# EAGLE schematic M8341D (EAGLE 6.6.0)

## Sheet 1 of 2
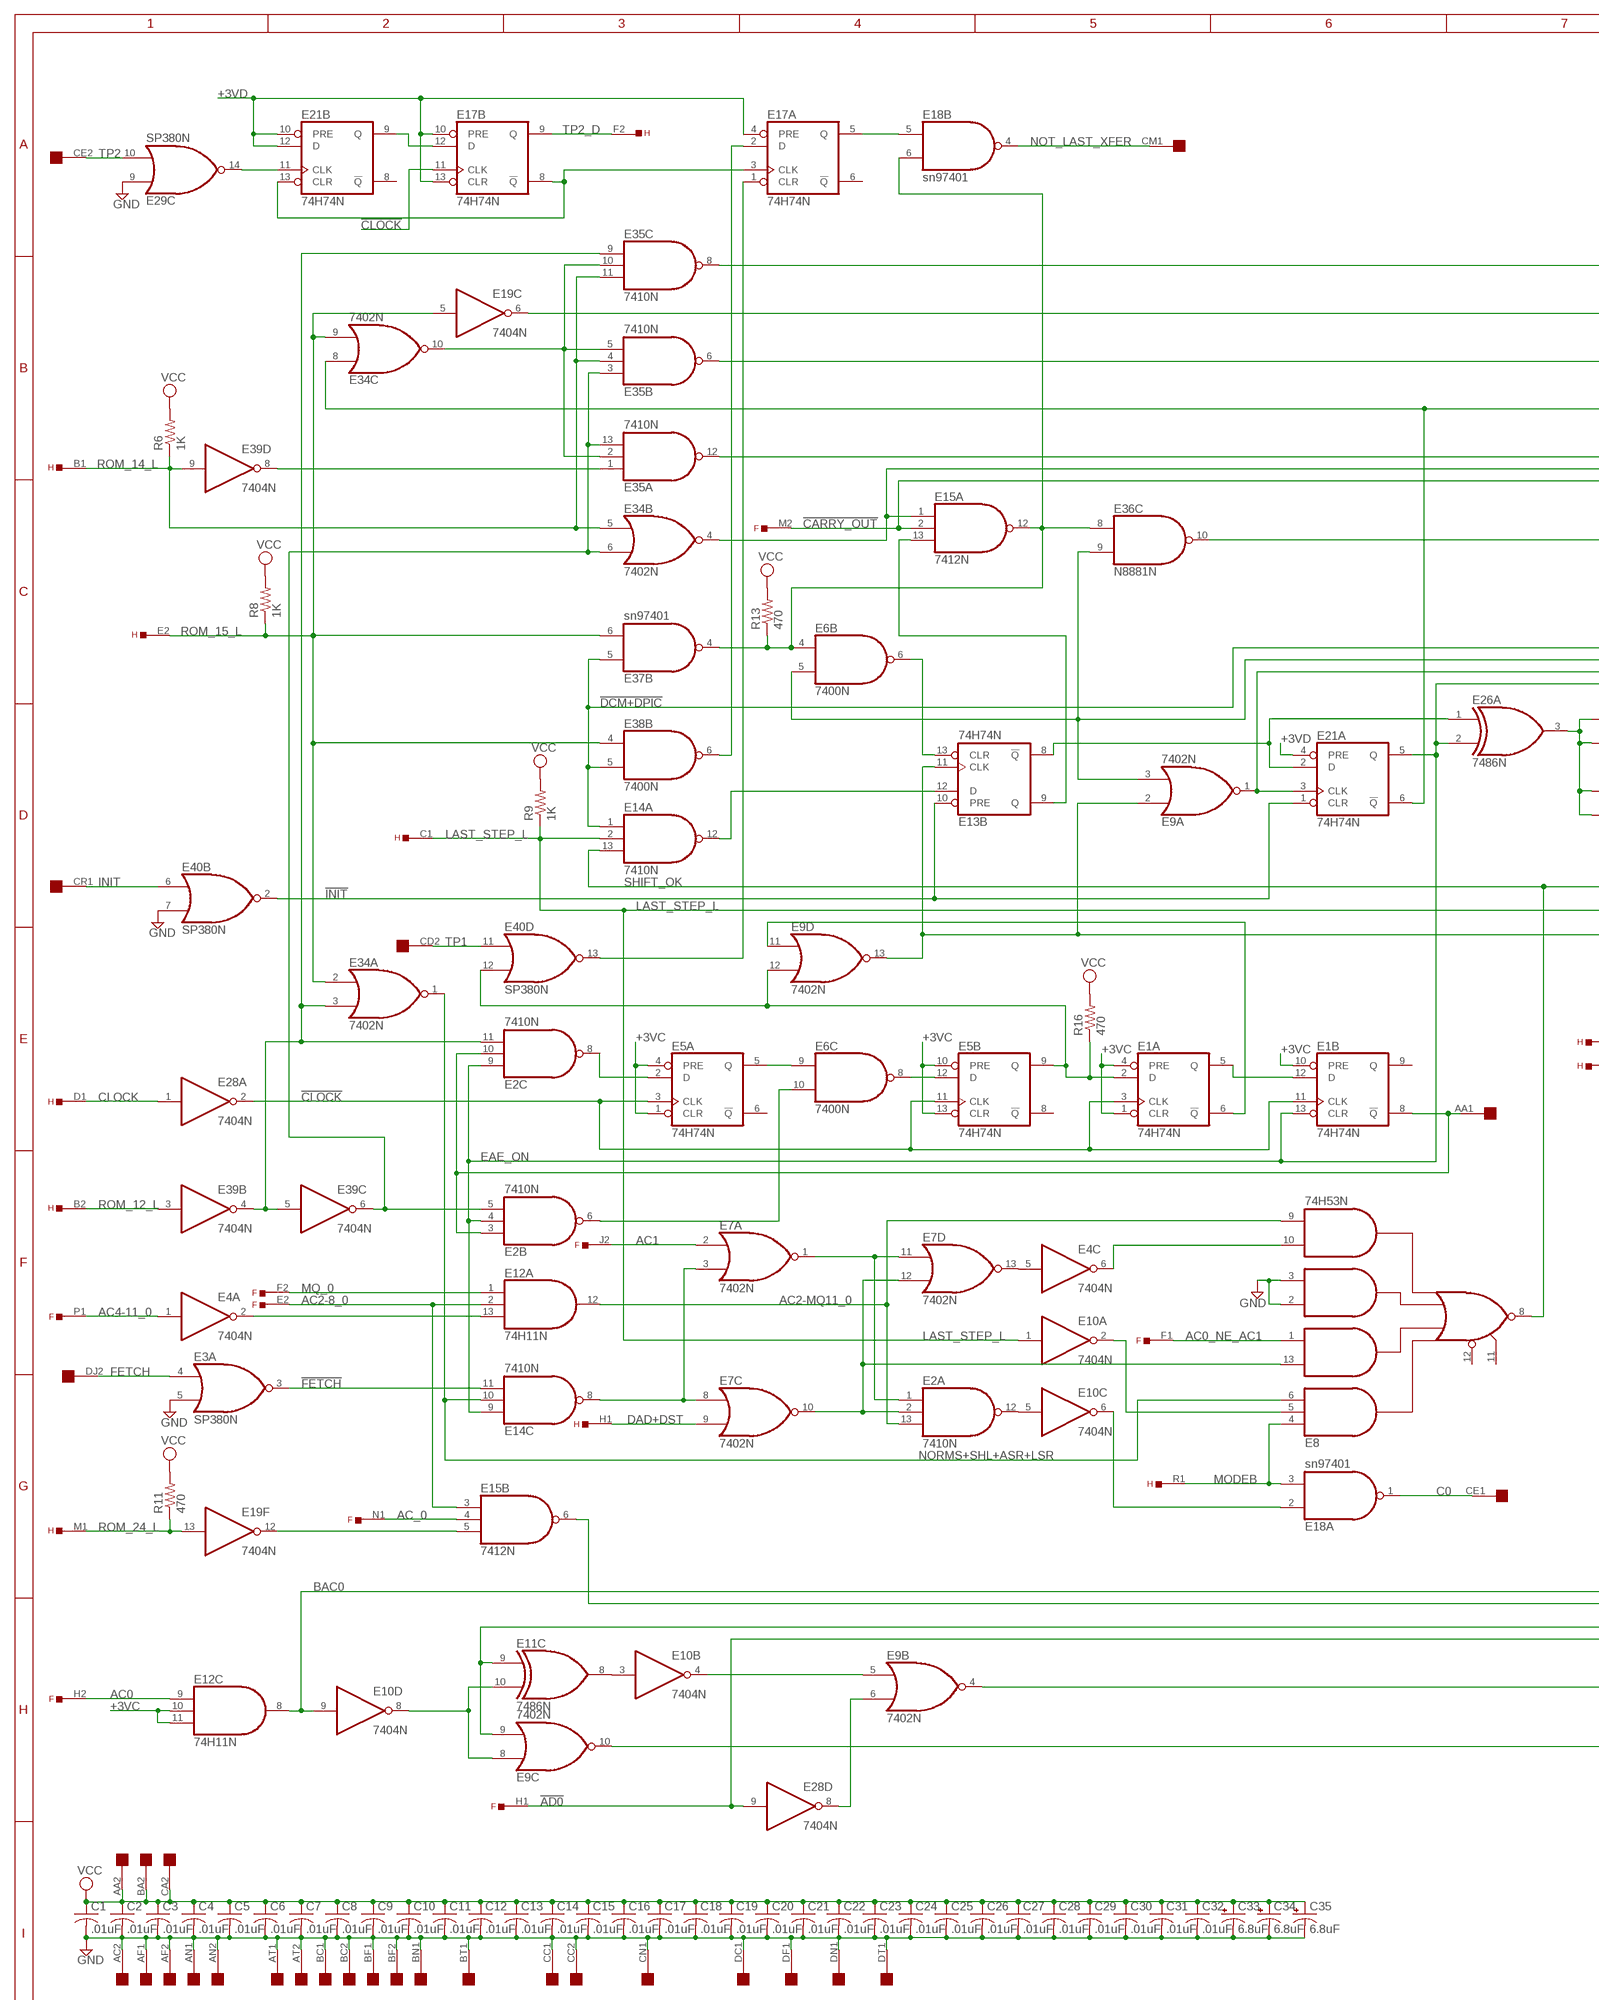
[diagram p0: schematic, sheet 1, part 1 of 2]
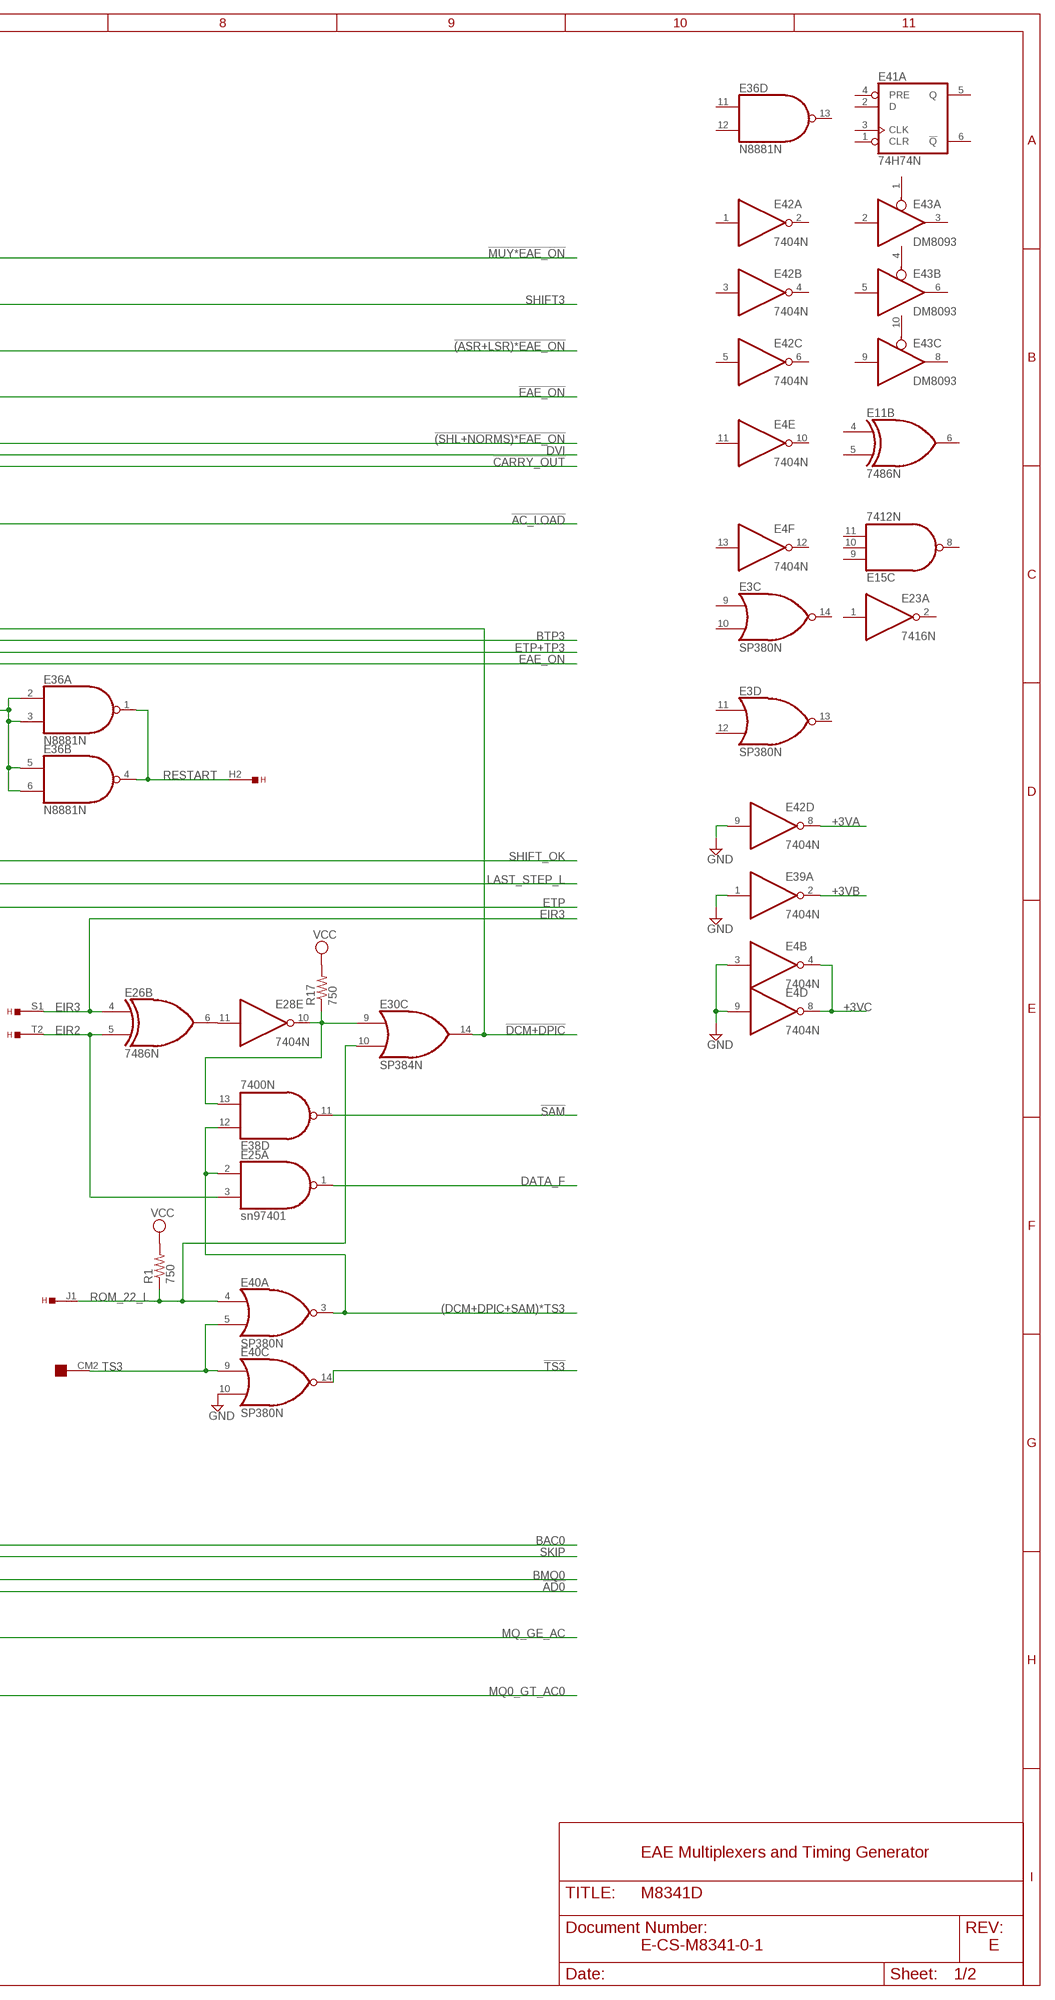
[diagram p1: schematic, sheet 1, part 2 of 2]

### Parts
C1  .01uF  C-US  [C063-025X075]
C2  .01uF  C-US  [C063-025X075]
C3  .01uF  C-US  [C063-025X075]
C4  .01uF  C-US  [C063-025X075]
C5  .01uF  C-US  [C063-025X075]
C6  .01uF  C-US  [C063-025X075]
C7  .01uF  C-US  [C063-025X075]
C8  .01uF  C-US  [C063-025X075]
C9  .01uF  C-US  [C063-025X075]
C10  .01uF  C-US  [C063-025X075]
C11  .01uF  C-US  [C063-025X075]
C12  .01uF  C-US  [C063-025X075]
C13  .01uF  C-US  [C063-025X075]
C14  .01uF  C-US  [C063-025X075]
C15  .01uF  C-US  [C063-025X075]
C16  .01uF  C-US  [C063-025X075]
C17  .01uF  C-US  [C063-025X075]
C18  .01uF  C-US  [C063-025X075]
C19  .01uF  C-US  [C063-025X075]
C20  .01uF  C-US  [C063-025X075]
C21  .01uF  C-US  [C063-025X075]
C22  .01uF  C-US  [C063-025X075]
C23  .01uF  C-US  [C063-025X075]
C24  .01uF  C-US  [C063-025X075]
C25  .01uF  C-US  [C063-025X075]
C26  .01uF  C-US  [C063-025X075]
C27  .01uF  C-US  [C063-025X075]
C28  .01uF  C-US  [C063-025X075]
C29  .01uF  C-US  [C063-025X075]
C30  .01uF  C-US  [C063-025X075]
C31  .01uF  C-US  [C063-025X075]
C32  .01uF  C-US  [C063-025X075]
C33  6.8uF  CPOL-USE20-8AXIAL  [E12-8]
C34  6.8uF  CPOL-USE20-8AXIAL  [E12-8]
C35  6.8uF  CPOL-USE20-8AXIAL  [E12-8]
E1  74H74N  74S74N  [DIL14]
E2  7410N  [DIL14]
E3  SP380N  [DIL14]
E4  7404N  [DIL14]
E5  74H74N  74S74N  [DIL14]
E6  7400N  [DIL14]
E7  7402N  [DIL14]
E8  74H53N  [DIL14]
E9  7402N  [DIL14]
E10  7404N  [DIL14]
E11  7486N  [DIL14]
E12  74H11N  74S11N  [DIL14]
E13  74H74N  74S74N  [DIL14]
E14  7410N  [DIL14]
E15  7412N  [DIL14]
E17  74H74N  74S74N  [DIL14]
E18  sn97401  74LS01N  [DIL14]
E19  7404N  [DIL14]
E21  74H74N  74S74N  [DIL14]
E23  7416N  [DIL14]
E25  sn97401  74LS01N  [DIL14]
E26  7486N  [DIL14]
E28  7404N  [DIL14]
E29  SP380N  [DIL14]
E30  SP384N  [DIL14]
E34  7402N  [DIL14]
E35  7410N  [DIL14]
E36  N8881N  [DIL14]
E37  sn97401  74LS01N  [DIL14]
E38  7400N  [DIL14]
E39  7404N  [DIL14]
E40  SP380N  [DIL14]
E41  74H74N  74S74N  [DIL14]
E42  7404N  [DIL14]
E43  DM8093  74125N  [DIL14]
F  EDGE-TOP  [EDGE-CON2]
H  EDGE-TOP  [EDGE-CON2]
R1  750  R-US_0207/10  [0207/10]
R6  1K  R-US_0207/10  [0207/10]
R8  1K  R-US_0207/10  [0207/10]
R9  1K  R-US_0207/10  [0207/10]
R11  470  R-US_0207/10  [0207/10]
R13  470  R-US_0207/10  [0207/10]
R16  470  R-US_0207/10  [0207/10]
R17  750  R-US_0207/10  [0207/10]
U$2  QUAD  [EDGE-CON8]

### Nets
!(ASR+LSR)*EAE_ON: E35.6(B:O) ; also sheet 2
!(SHL+NORMS)*EAE_ON: E35.12(A:O) ; also sheet 2
!AC_LOAD: E36.10(C:O) ; also sheet 2
!AD0: E28.9(D:I) F.H1 ; also sheet 2
!CARRY_OUT: E15.2(A:I1) F.M2 ; also sheet 2
!CLOCK: E1.3(A:CLK) E1.11(B:CLK) E5.3(A:CLK) E5.11(B:CLK) E17.11(B:CLK) E28.2(A:O)
!DCM+DPIC: E14.1(A:I0) E30.14(C:O) E37.5(B:I0) E38.5(B:I1) ; also sheet 2
!EAE_ON: E21.6(A:!Q) E34.8(C:I0) ; also sheet 2
!FETCH: E3.3(A:O) E14.11(C:I2)
!INIT: E13.10(B:PRE) E21.1(A:CLR) E40.2(B:O)
!MUY*EAE_ON: E35.8(C:O) ; also sheet 2
!SAM: E38.11(D:O) ; also sheet 2
!TS3: E40.14(C:O) ; also sheet 2
(DCM+DPIC+SAM)*TS3: E25.2(A:I0) E38.12(D:I0) E40.3(A:O) ; also sheet 2
+3VA: E42.8(D:O) ; also sheet 2
+3VB: E39.2(A:O) ; also sheet 2
+3VC: E1.1(A:CLR) E1.4(A:PRE) E1.10(B:PRE) E4.4(B:O) E4.8(D:O) E5.1(A:CLR) E5.4(A:PRE) E5.10(B:PRE) E5.13(B:CLR) E12.10(C:I1) E12.11(C:I2) ; also sheet 2
+3VD: E17.4(A:PRE) E17.10(B:PRE) E17.13(B:CLR) E21.4(A:PRE) E21.10(B:PRE) E21.12(B:D) ; also sheet 2
AC0: E12.9(C:I0) F.H2
AC0_NE_AC1: E8.1(I4) F.F1
AC1: E7.2(A:I0) F.J2
AC2-8_0: E12.2(A:I1) E15.3(B:I0) F.E2
AC2-MQ11_0: E2.13(A:I2) E8.9(I8) E12.12(A:O)
AC4-11_0: E4.1(A:I) F.P1
AC_0: E15.4(B:I1) F.N1
BAC0: E10.9(D:I) E12.8(C:O) ; also sheet 2
BMQ0: E9.9(C:I1) E11.9(C:I0) ; also sheet 2
BTP3: E6.5(B:I1) E9.3(A:I1) E36.9(C:I1) ; also sheet 2
C0: E18.1(A:O) U$2.CE1
CLOCK: E28.1(A:I) H.D1
DAD+DST: E7.9(C:I1) H.H1
DATA_F: E25.1(A:O) ; also sheet 2
DVI: E15.1(A:I0) E34.4(B:O) ; also sheet 2
EAE_ON: E1.13(B:CLR) E2.4(B:I1) E2.9(C:I0) E14.9(C:I0) E21.5(A:Q) E26.2(A:I1) ; also sheet 2
EIR2: E25.3(A:I1) E26.5(B:I1) H.T2
EIR3: E26.4(B:I0) H.S1 ; also sheet 2
ETP: E9.2(A:I0) E9.13(D:O) E13.11(B:CLK) ; also sheet 2
ETP+TP3: E9.1(A:O) E21.3(A:CLK) ; also sheet 2
FETCH: E3.4(A:I0) U$2.DJ2
GND [supply]: C1.2 C2.2 C3.2 C4.2 C5.2 C6.2 C7.2 C8.2 C9.2 C10.2 C11.2 C12.2 C13.2 C14.2 C15.2 C16.2 C17.2 C18.2 C19.2 C20.2 C21.2 C22.2 C23.2 C24.2 C25.2 C26.2 C27.2 C28.2 C29.2 C30.2 C31.2 C32.2 C33.- C34.- C35.- E3.5(A:I1) E4.3(B:I) E4.9(D:I) E8.2(I5) E8.3(I6) E29.9(C:I0) E39.1(A:I) E40.7(B:I1) E40.10(C:I1) E42.9(D:I) U$2.AC2 U$2.AF1 U$2.AF2 U$2.AN1 U$2.AN2 U$2.AT1 U$2.AT2 U$2.BC1 U$2.BC2 U$2.BF1 U$2.BF2 U$2.BN1 U$2.BT1 U$2.CC1 U$2.CC2 U$2.CN1 U$2.DC1 U$2.DF1 U$2.DN1 U$2.DT1 ; also sheet 2
INIT: E40.6(B:I0) U$2.CR1
LAST_STEP_L: E10.1(A:I) E14.2(A:I1) H.C1 R9.1 ; also sheet 2
MODEB: E8.4(I1) E18.3(A:I1) H.R1 ; also sheet 2
MQ0_GT_AC0: E9.10(C:O) ; also sheet 2
MQ_0: E12.1(A:I0) F.F2
MQ_GE_AC: E9.4(B:O) ; also sheet 2
N$2: E21.11(B:CLK) E29.14(C:O)
N$3: E26.3(A:O) E36.2(A:I0) E36.3(A:I1) E36.5(B:I0) E36.6(B:I1)
N$4: E6.4(B:I0) E15.12(A:O) E18.6(B:I1) E36.8(C:I0) E37.4(B:O) R13.1
N$6: E4.2(A:O) E12.13(A:I2)
N$7: E13.8(B:!Q) E21.2(A:D) E26.1(A:I0)
N$8: E2.5(B:I2) E34.6(B:I1) E35.3(B:I0) E35.13(A:I2) E39.6(C:O)
N$11: E9.8(C:I0) E10.8(D:O) E11.10(C:I1)
N$14: E15.5(B:I2) E19.12(F:O)
N$15: E7.3(A:I1) E7.8(C:I0) E14.8(C:O)
N$16: E9.6(B:I1) E28.8(D:O)
N$17: E9.5(B:I0) E10.4(B:O)
N$18: E2.2(A:I1) E7.10(C:O) E7.12(D:I1) E8.13(I3)
N$19: E2.12(A:O) E10.5(C:I)
N$20: E10.6(C:O) E18.2(A:I0)
N$21: E5.12(B:D) E6.8(C:O)
N$22: E1.2(A:D) E5.9(B:Q) E9.12(D:I1) E40.12(D:I1) R16.1
N$23: E1.5(A:Q) E1.12(B:D)
N$24: E26.6(B:O) E28.11(E:I)
N$27: E2.1(A:I0) E7.1(A:O) E7.11(D:I0)
N$28: E4.5(C:I) E7.13(D:O)
N$29: E4.6(C:O) E8.10(I7)
N$30: E8.5(I11) E10.2(A:O)
N$36: E28.10(E:O) E30.9(C:I0) E38.13(D:I1) R17.1
N$58: E35.1(A:I0) E39.8(D:O)
N$59: E17.3(A:CLK) E17.8(B:!Q) E21.13(B:CLR)
N$60: E17.12(B:D) E21.9(B:Q)
N$61: E34.10(C:O) E35.2(A:I1) E35.5(B:I2) E35.10(C:I1)
N$62: E1.6(A:!Q) E9.11(D:I0)
N$63: E2.8(C:O) E5.2(A:D)
N$65: E5.5(A:Q) E6.9(C:I0)
N$67: E17.2(A:D) E38.6(B:O)
N$68: E17.1(A:CLR) E40.13(D:O)
N$69: E17.5(A:Q) E18.5(B:I0)
N$73: E6.6(B:O) E13.13(B:CLR)
N$74: E13.12(B:D) E14.12(A:O)
N$76: E2.6(B:O) E6.10(C:I1)
N$77: E10.3(B:I) E11.8(C:O)
N$84: E13.9(B:Q) E15.13(A:I2)
NORMS+SHL+ASR+LSR: E8.6(I2) E14.10(C:I1) E34.1(A:O)
NOT_LAST_XFER: E18.4(B:O) U$2.CM1
RESTART: E36.1(A:O) E36.4(B:O) H.H2
ROM_12: E2.11(C:I2) E34.3(A:I1) E35.9(C:I0) E39.4(B:O) E39.5(C:I)
ROM_12_L: E39.3(B:I) H.B2
ROM_14_L: E34.5(B:I0) E35.4(B:I1) E35.11(C:I2) E39.9(D:I) H.B1 R6.1
ROM_15_L: E19.5(C:I) E34.2(A:I0) E34.9(C:I1) E37.6(B:I1) E38.4(B:I0) H.E2 R8.1
ROM_22_L: E30.10(C:I1) E40.4(A:I0) H.J1 R1.1
ROM_24_L: E19.13(F:I) H.M1 R11.1
SHIFT3: E19.6(C:O) ; also sheet 2
SHIFT_OK: E8.8(O) E14.13(A:I2) ; also sheet 2
SKIP: E15.6(B:O) ; also sheet 2
TP: E1.8(B:!Q) E2.3(B:I0) E2.10(C:I1) U$2.AA1
TP1: E40.11(D:I0) U$2.CD2
TP2: E29.10(C:I1) U$2.CE2
TP2_D: E17.9(B:Q) H.F2
TS3: E40.5(A:I1) E40.9(C:I0) U$2.CM2
VCC [supply]: C1.1 C2.1 C3.1 C4.1 C5.1 C6.1 C7.1 C8.1 C9.1 C10.1 C11.1 C12.1 C13.1 C14.1 C15.1 C16.1 C17.1 C18.1 C19.1 C20.1 C21.1 C22.1 C23.1 C24.1 C25.1 C26.1 C27.1 C28.1 C29.1 C30.1 C31.1 C32.1 C33.+ C34.+ C35.+ R1.2 R6.2 R8.2 R9.2 R11.2 R13.2 R16.2 R17.2 U$2.AA2 U$2.BA2 U$2.CA2 ; also sheet 2
Unconnected: E1.9(B:Q) E3.9(C:I0) E3.10(C:I1) E3.11(D:I0) E3.12(D:I1) E3.13(D:O) E3.14(C:O) E4.10(E:O) E4.11(E:I) E4.12(F:O) E4.13(F:I) E5.6(A:!Q) E5.8(B:!Q) E8.11(I10) E8.12(I9) E11.4(B:I0) E11.5(B:I1) E11.6(B:O) E15.8(C:O) E15.9(C:I0) E15.10(C:I1) E15.11(C:I2) E17.6(A:!Q) E21.8(B:!Q) E23.1(A:I) E23.2(A:O) E36.11(D:I0) E36.12(D:I1) E36.13(D:O) E41.1(A:CLR) E41.2(A:D) E41.3(A:CLK) E41.4(A:PRE) E41.5(A:Q) E41.6(A:!Q) E42.1(A:I) E42.2(A:O) E42.3(B:I) E42.4(B:O) E42.5(C:I) E42.6(C:O) E43.1(A:OE) E43.2(A:I) E43.3(A:O) E43.4(B:OE) E43.5(B:I) E43.6(B:O) E43.8(C:O) E43.9(C:I) E43.10(C:OE) F.R1 U$2.AB1 U$2.AB2 U$2.AC1 U$2.AD1 U$2.AD2 U$2.AE1 U$2.AE2 U$2.AH1 U$2.AH2 U$2.AJ1 U$2.AJ2 U$2.AK1 U$2.AK2 U$2.AL1 U$2.AL2 U$2.AM1 U$2.AM2 U$2.AP1 U$2.AP2 U$2.AR1 U$2.AR2 U$2.AS2 U$2.AU1 U$2.AU2 U$2.AV1 U$2.BA1 U$2.BB1 U$2.BB2 U$2.BD1 U$2.BD2 U$2.BE1 U$2.BE2 U$2.BH1 U$2.BH2 U$2.BJ1 U$2.BJ2 U$2.BK1 U$2.BK2 U$2.BL1 U$2.BL2 U$2.BM1 U$2.BM2 U$2.BN2 U$2.BP1 U$2.BP2 U$2.BR1 U$2.BR2 U$2.BS1 U$2.BS2 U$2.BT2 U$2.BU1 U$2.BU2 U$2.BV1 U$2.BV2 U$2.CA1 U$2.CB1 U$2.CB2 U$2.CD1 U$2.CF1 U$2.CF2 U$2.CH1 U$2.CJ1 U$2.CJ2 U$2.CK1 U$2.CK2 U$2.CL1 U$2.CN2 U$2.CP1 U$2.CT1 U$2.CT2 U$2.CU1 U$2.CU2 U$2.CV2 U$2.DA1 U$2.DA2 U$2.DB1 U$2.DB2 U$2.DC2 U$2.DD1 U$2.DD2 U$2.DE1 U$2.DE2 U$2.DF2 U$2.DH1 U$2.DH2 U$2.DJ1 U$2.DK1 U$2.DK2 U$2.DL1 U$2.DM1 U$2.DM2 U$2.DN2 U$2.DP1 U$2.DP2 U$2.DR1 U$2.DR2 U$2.DS1 U$2.DS2 U$2.DT2 U$2.DU1 U$2.DU2 U$2.DV1 U$2.DV2

### Notes on the sheet
- EAE Multiplexers and Timing Generator
- E-CS-M8341-0-1 | E

## Sheet 2 of 2
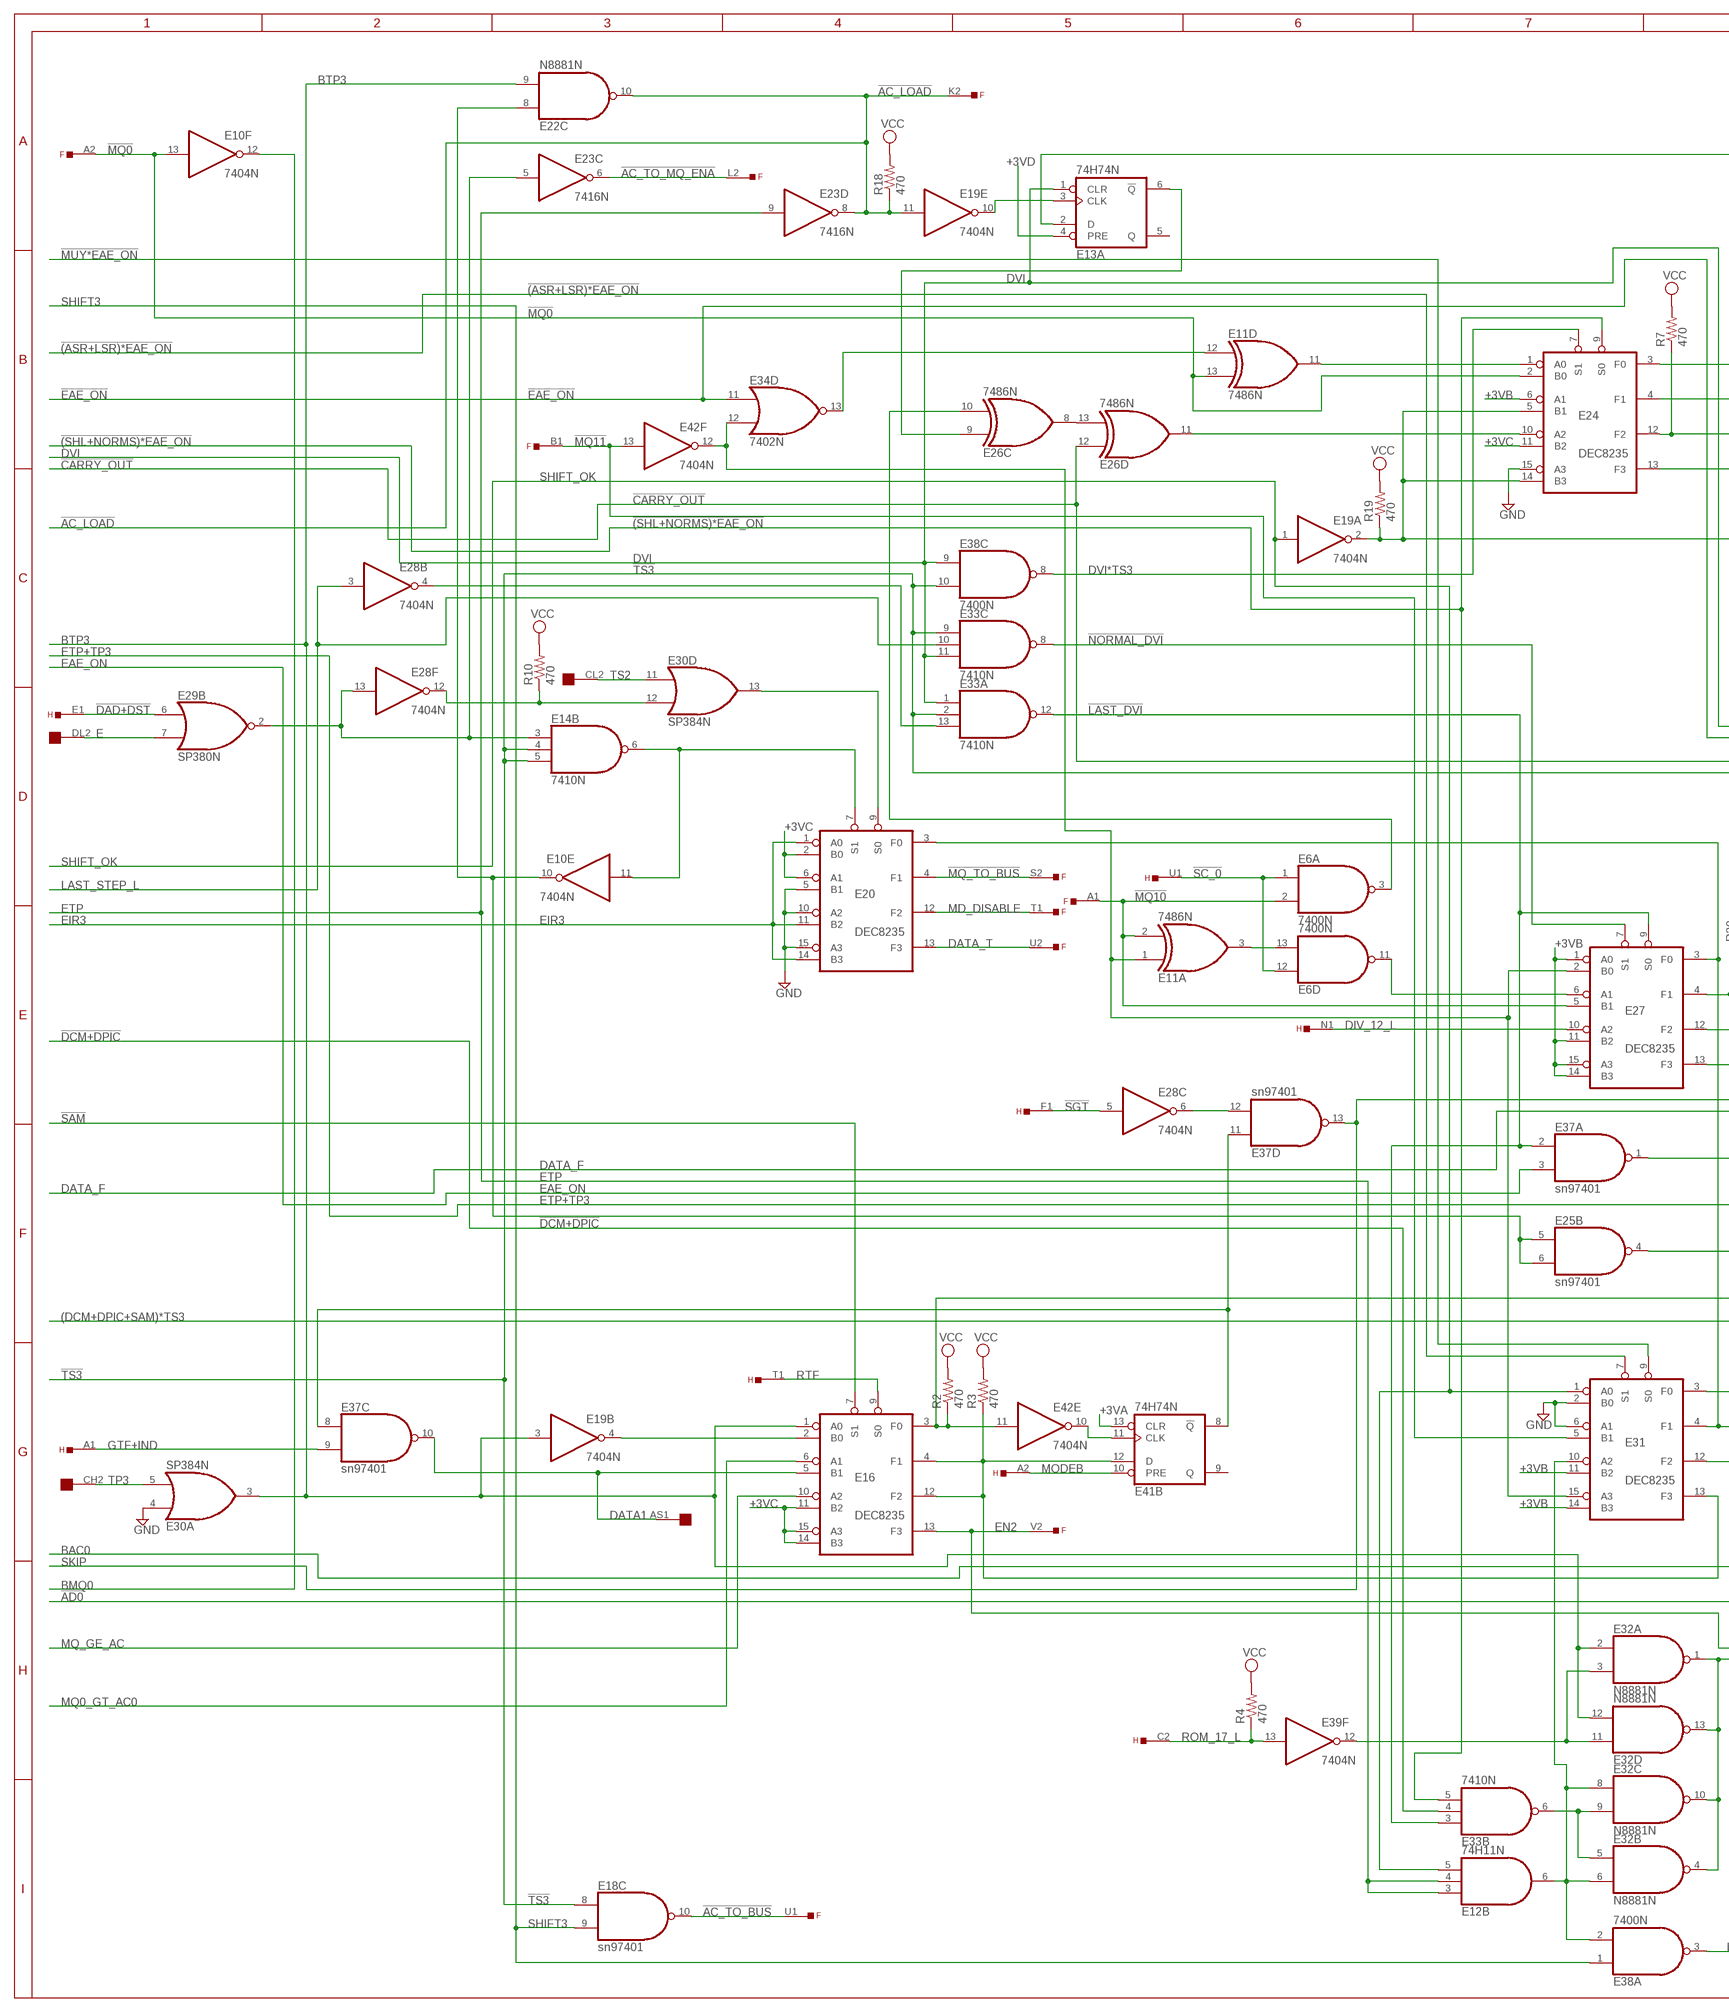
[diagram p2: schematic, sheet 2, part 1 of 2]
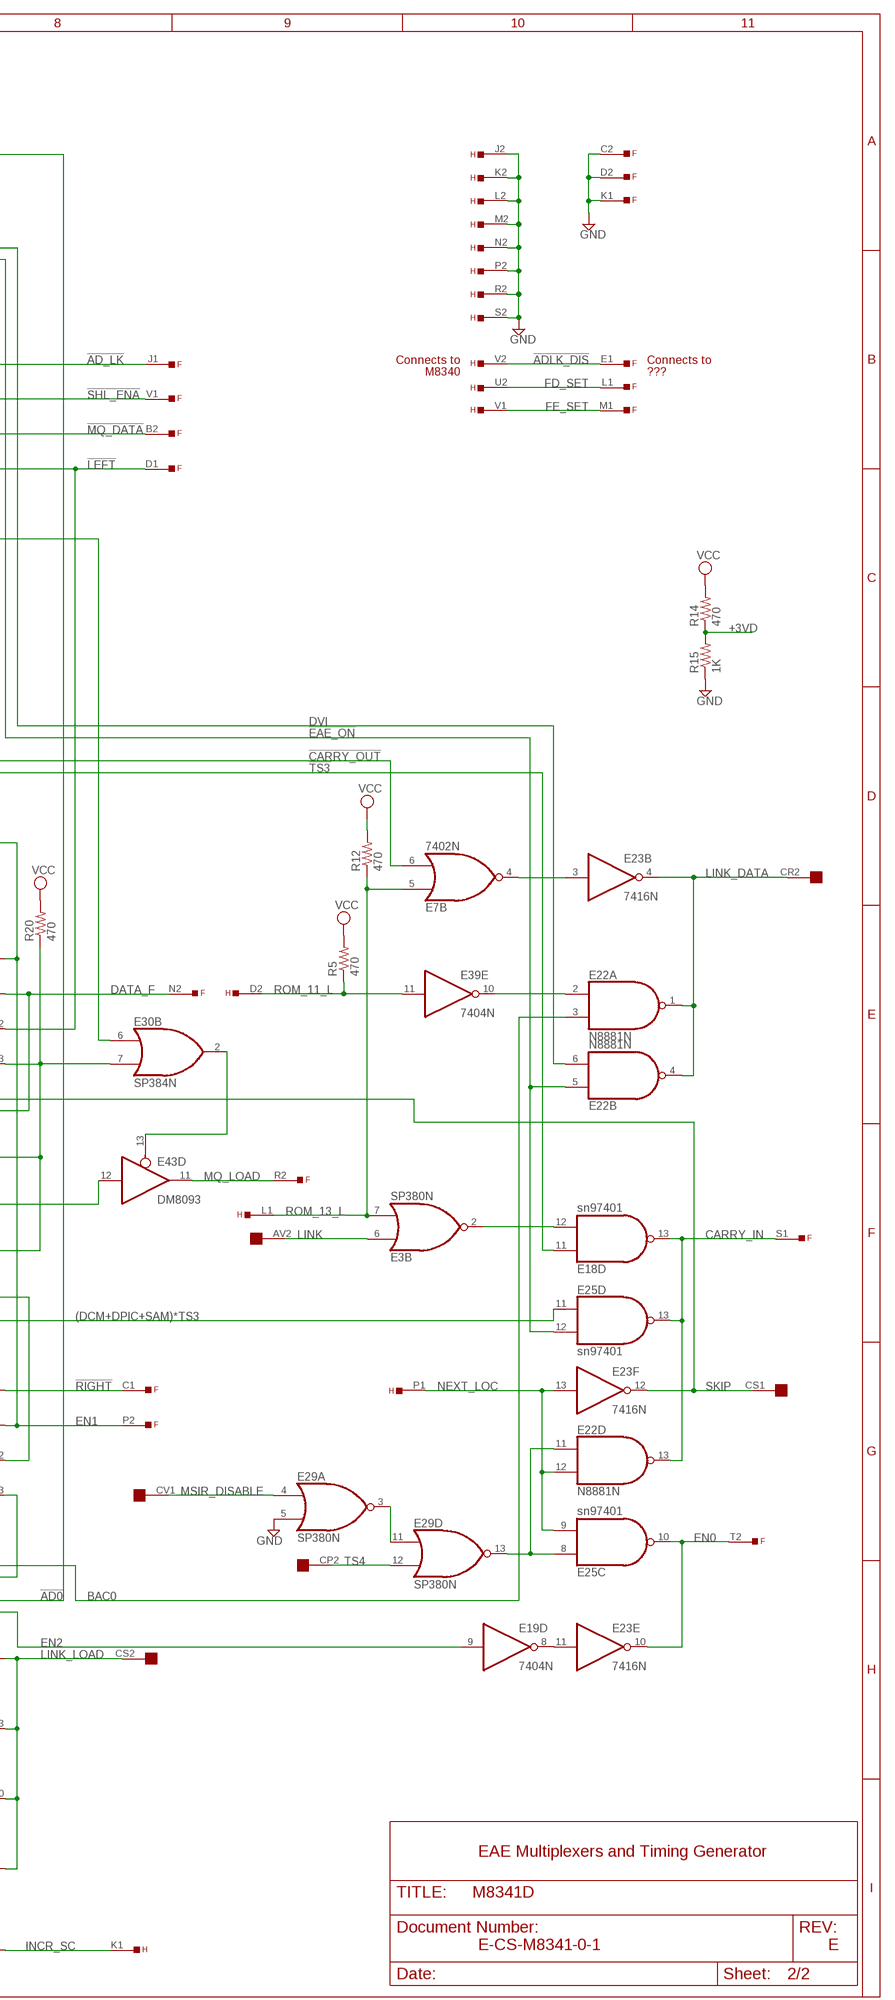
[diagram p3: schematic, sheet 2, part 2 of 2]

### Parts
E16  DEC8235  [DIL16]
E20  DEC8235  [DIL16]
E22  N8881N  [DIL14]
E24  DEC8235  [DIL16]
E27  DEC8235  [DIL16]
E31  DEC8235  [DIL16]
E32  N8881N  [DIL14]
E33  7410N  [DIL14]
R2  470  R-US_0207/10  [0207/10]
R3  470  R-US_0207/10  [0207/10]
R4  470  R-US_0207/10  [0207/10]
R5  470  R-US_0207/10  [0207/10]
R7  470  R-US_0207/10  [0207/10]
R10  470  R-US_0207/10  [0207/10]
R12  470  R-US_0207/10  [0207/10]
R14  470  R-US_0207/10  [0207/10]
R15  1K  R-US_0207/10  [0207/10]
R18  470  R-US_0207/10  [0207/10]
R19  470  R-US_0207/10  [0207/10]
R20  470  R-US_0207/10  [0207/10]

### Nets
!(ASR+LSR)*EAE_ON: E31.7(S1) ; also sheet 1
!(SHL+NORMS)*EAE_ON: E24.9(S0) E33.5(B:I2) ; also sheet 1
!AC_LOAD: E19.11(E:I) E22.10(C:O) E23.8(D:O) F.K2 R18.1 ; also sheet 1
!AC_TO_BUS: E18.10(C:O) F.U1
!AC_TO_MQ_ENA: E23.6(C:O) F.L2
!AD0: E13.2(A:D) ; also sheet 1
!AD_LK: E24.3(F0) F.J1
!ADLK_DIS: F.E1 H.V2
!CARRY_OUT: E7.6(B:I1) E26.12(D:I0) ; also sheet 1
!DAD+DST: E29.6(B:I0) H.E1
!DCM+DPIC: E33.4(B:I1) ; also sheet 1
!EAE_ON: E22.5(B:I0) E25.12(D:I1) E34.11(D:I0) ; also sheet 1
!LAST_DVI: E27.9(S0) E33.3(B:I0) E33.12(A:O) E37.2(A:I0)
!LEFT: E24.13(F3) E27.12(F2) F.D1
!MQ0: E10.13(F:I) E11.13(D:I1) E24.2(B0) F.A2
!MQ10: E6.2(A:I1) E11.2(A:I1) E27.5(B1) F.A1
!MQ11: E31.5(B1) E42.13(F:I) F.B1
!MQ_DATA: E24.12(F2) F.B2 R7.1
!MQ_TO_BUS: E20.4(F1) F.S2
!MUY*EAE_ON: E31.9(S0) ; also sheet 1
!NORMAL_DVI: E27.7(S1) E33.8(C:O)
!RIGHT: E31.3(F0) F.C1
!SAM: E16.7(S1) ; also sheet 1
!SC_0: E6.1(A:I0) E6.12(D:I0) H.U1
!SGT: E28.5(C:I) H.F1
!SHL_ENA: E24.4(F1) F.V1
!TS3: E14.4(B:I1) E14.5(B:I2) E18.8(C:I0) E18.11(D:I0) E33.2(A:I1) E33.9(C:I0) E38.10(C:I1) ; also sheet 1
(DCM+DPIC+SAM)*TS3: E25.11(D:I0) ; also sheet 1
+3VA: E41.13(B:CLR) ; also sheet 1
+3VB: E24.6(A1) E27.1(A0) E27.11(B2) E27.14(B3) E27.15(A3) E31.11(B2) E31.14(B3) ; also sheet 1
+3VC: E16.11(B2) E16.14(B3) E16.15(A3) E20.2(B0) E20.6(A1) E24.11(B2) ; also sheet 1
+3VD: E13.4(A:PRE) R14.1 R15.2 ; also sheet 1
BAC0: E22.3(A:I1) ; also sheet 1
BMQ0: E10.12(F:O) ; also sheet 1
BTP3: E16.1(A0) E19.3(B:I) E22.9(C:I1) E30.3(A:O) E32.2(A:I0) E32.12(D:I1) ; also sheet 1
CARRY_IN: E18.13(D:O) E22.13(D:O) E25.13(D:O) F.S1
DATA1: E16.5(B1) E37.10(C:O) U$2.AS1
DATA_F: E27.4(F1) F.N2 ; also sheet 1
DATA_T: E20.13(F3) F.U2
DIV_12_L: E27.10(A2) H.N1
DVI: E13.1(A:CLR) E22.6(B:I1) E33.1(A:I0) E33.11(C:I2) E38.9(C:I0) ; also sheet 1
DVI*TS3: E24.7(S1) E38.8(C:O)
E: E29.7(B:I1) U$2.DL2
EAE_ON: E37.3(A:I1) ; also sheet 1
EIR3: E20.1(A0) E20.11(B2) E20.14(B3) ; also sheet 1
EN0: E23.10(E:O) E25.10(C:O) F.T2
EN1: E20.3(F0) E27.3(F0) E31.4(F1) F.P2
EN2: E16.13(F3) E19.9(D:I) F.V2
ETP: E12.3(B:I0) E12.4(B:I1) E23.9(D:I) ; also sheet 1
ETP+TP3: E43.12(D:I) ; also sheet 1
FD_SET: F.L1 H.U2
FE_SET: F.M1 H.V1
GND [supply]: E20.5(B1) E20.10(A2) E20.15(A3) E24.15(A3) E29.5(A:I1) E30.4(A:I0) E31.2(B0) E31.6(A1) F.C2 F.D2 F.K1 H.J2 H.K2 H.L2 H.M2 H.N2 H.P2 H.R2 H.S2 R15.1 ; also sheet 1
GTF+IND: E37.9(C:I1) H.A1
INCR_SC: E38.3(A:O) H.K1
LAST_STEP_L: E28.3(B:I) E33.10(C:I1) ; also sheet 1
LINK: E3.6(B:I0) U$2.AV2
LINK_DATA: E22.1(A:O) E22.4(B:O) E23.4(B:O) U$2.CR2
LINK_LOAD: E32.1(A:O) E32.4(B:O) E32.10(C:O) E32.13(D:O) U$2.CS2
MD_DISABLE: E20.12(F2) F.T1
MODEB: E41.10(B:PRE) H.A2 ; also sheet 1
MQ0_GT_AC0: E16.6(A1) ; also sheet 1
MQ_GE_AC: E16.10(A2) ; also sheet 1
MQ_LOAD: E43.11(D:O) F.R2
MSIR_DISABLE: E29.4(A:I0) U$2.CV1
N$1: E11.1(A:I0) E27.2(B0) E31.15(A3) E34.12(D:I1) E42.12(F:O)
N$5: E20.9(S0) E30.13(D:O)
N$12: E10.10(E:O) E22.8(C:I0) E25.5(B:I0) E25.6(B:I1)
N$13: E37.8(C:I0) E37.11(D:I0) E41.8(B:!Q)
N$25: E16.2(B0) E19.4(B:O)
N$31: E14.3(B:I0) E23.5(C:I) E28.13(F:I) E29.2(B:O)
N$32: E28.12(F:O) E30.12(D:I1) R10.1
N$33: E10.11(E:I) E14.6(B:O) E20.7(S1)
N$34: E11.11(D:O) E24.1(A0)
N$37: E13.3(A:CLK) E19.10(E:O)
N$38: E6.3(A:O) E26.10(C:I1)
N$39: E28.6(C:O) E37.12(D:I1)
N$40: E16.4(F1) E16.12(F2) E31.13(F3) E41.12(B:D) R3.1
N$41: E41.11(B:CLK) E42.10(E:O)
N$42: E13.6(A:!Q) E26.9(C:I0)
N$43: E16.3(F0) E31.12(F2) E42.11(E:I) R2.1
N$44: E32.5(B:I0) E32.9(C:I1) E33.6(B:O)
N$46: E25.4(B:O) E27.13(F3) E30.7(B:I1) E37.1(A:O) R20.1
N$47: E19.2(A:O) E24.5(B1) E24.14(B3) E30.6(B:I0) R19.1
N$49: E7.4(B:O) E23.3(B:I)
N$50: E22.2(A:I0) E39.10(E:O)
N$52: E30.2(B:O) E43.13(D:OE)
N$53: E3.2(B:O) E18.12(D:I1)
N$55: E29.3(A:O) E29.11(D:I0)
N$56: E22.11(D:I0) E25.8(C:I0) E29.13(D:O)
N$57: E19.8(D:O) E23.11(E:I)
N$64: E12.6(B:O) E31.10(A2) E32.6(B:I1) E32.8(C:I0) E38.2(A:I1)
N$66: E24.10(A2) E26.11(D:O)
N$70: E11.12(D:I0) E34.13(D:O)
N$71: E32.3(A:I1) E32.11(D:I0) E39.12(F:O)
N$82: E6.11(D:O) E27.6(A1)
N$85: E6.13(D:I1) E11.3(A:O)
N$91: E28.4(B:O) E33.13(A:I2)
N$92: E26.8(C:O) E26.13(D:I1)
NEXT_LOC: E22.12(D:I1) E23.13(F:I) E25.9(C:I1) H.P1
ROM_11_L: E39.11(E:I) H.D2 R5.1
ROM_13_L: E3.7(B:I1) E7.5(B:I0) H.L1 R12.1
ROM_17_L: E39.13(F:I) H.C2 R4.1
RTF: E16.9(S0) H.T1
SHIFT3: E18.9(C:I1) E38.1(A:I0) ; also sheet 1
SHIFT_OK: E12.5(B:I2) E19.1(A:I) E31.1(A0) ; also sheet 1
SKIP: E23.12(F:O) E37.13(D:O) U$2.CS1 ; also sheet 1
TP3: E30.5(A:I1) U$2.CH2
TS2: E30.11(D:I0) U$2.CL2
TS4: E29.12(D:I1) U$2.CP2
VCC [supply]: R2.2 R3.2 R4.2 R5.2 R7.2 R10.2 R12.2 R14.2 R18.2 R19.2 R20.2 ; also sheet 1
Unconnected: E13.5(A:Q) E41.9(B:Q)

### Notes on the sheet
- Connects to | Connects to
- M8340 | ???
- EAE Multiplexers and Timing Generator
- E-CS-M8341-0-1 | E

## Power pins joined to a net without a drawn wire
GND: E1.7(P:GND) E2.7(P:GND) E3.1(P:GND) E4.7(P:GND) E5.7(P:GND) E6.7(P:GND) E7.7(P:GND) E8.7(GND) E9.7(P:GND) E10.7(P:GND) E11.7(P:GND) E12.7(P:GND) E13.7(P:GND) E14.7(P:GND) E15.7(P:GND) E16.8(GND) E17.7(P:GND) E18.7(P:GND) E19.7(P:GND) E20.8(GND) E21.7(P:GND) E22.7(P:GND) E23.7(P:GND) E24.8(GND) E25.7(P:GND) E26.7(P:GND) E27.8(GND) E28.7(P:GND) E29.1(P:GND) E30.1(GND) E31.8(GND) E32.7(P:GND) E33.7(P:GND) E34.7(P:GND) E35.7(P:GND) E36.7(P:GND) E37.7(P:GND) E38.7(P:GND) E39.7(P:GND) E40.1(P:GND) E41.7(P:GND) E42.7(P:GND) E43.7(P:GND)
VCC: E1.14(P:VCC) E2.14(P:VCC) E3.8(P:VCC) E4.14(P:VCC) E5.14(P:VCC) E6.14(P:VCC) E7.14(P:VCC) E8.14(VCC) E9.14(P:VCC) E10.14(P:VCC) E11.14(P:VCC) E12.14(P:VCC) E13.14(P:VCC) E14.14(P:VCC) E15.14(P:VCC) E16.16(VCC) E17.14(P:VCC) E18.14(P:VCC) E19.14(P:VCC) E20.16(VCC) E21.14(P:VCC) E22.14(P:VCC) E23.14(P:VCC) E24.16(VCC) E25.14(P:VCC) E26.14(P:VCC) E27.16(VCC) E28.14(P:VCC) E29.8(P:VCC) E30.8(VCC) E31.16(VCC) E32.14(P:VCC) E33.14(P:VCC) E34.14(P:VCC) E35.14(P:VCC) E36.14(P:VCC) E37.14(P:VCC) E38.14(P:VCC) E39.14(P:VCC) E40.8(P:VCC) E41.14(P:VCC) E42.14(P:VCC) E43.14(P:VCC)

## Library data of the parts
C1-C32 = dec-con:C-US: Capacitors with funky DEC lead spacing.
C33-C35 = dec-con:CPOL-USE20-8AXIAL: A 0.8 inch electrolytic.
E1 E5 E13 E17 E21 E41 = 74xx-us:74*74: Dual D type positive edge triggered FLIP FLOP, preset and clear
E2 E14 E33 E35 = 74xx-us:74*10: Triple 3-input NAND gate
E3 E29 E40 = dec-con:SP380: Quad NOR gate (use 8640)
E4 E10 E19 E28 E39 E42 = 74xx-us:74*04: Hex INVERTER
E6 E38 = 74xx-us:74*00: Quad 2-input NAND gate
E7 E9 E34 = 74xx-us:74*02: Quad 2-input NOR gate
E8 = dec-con:74H53N: 2-2-2-3 Input And-Or-Invert Gate
E11 E26 = 74xx-us:74*86: Quad 2-input EXCLUSIV-OR (XOR) gate
E12 = 74xx-us:74*11: Triple 3-input AND gate
E15 = 74xx-us:74*12: Triple 3-input NAND gate, open collector
E16 E20 E24 E27 E31 = dec-con:DEC8235: 4-bit data selector
E18 E25 E37 = 74xx-us:74*01: Quad 2-input NAND gate, open collector
E22 E32 E36 = dec-con:N8881: Quad 2-input NAND gate, open collector
E23 = 74xx-us:74*16: Hex INVERTER, open collector, high-voltage
E30 = dec-con:SP384: Quad OR gate
E43 = 74xx-us:74*125: Quad bus BUFFER, 3-state
F H = dec-con:EDGE-TOP: Labeled DEC edge connector, suitable for top connector.
R1-R20 = rcl:R-US_: RESISTOR, American symbol
U$2 = dec-con:QUAD: Quad-Height DEC board

## Net classes
1 supply: width 0.813 mm